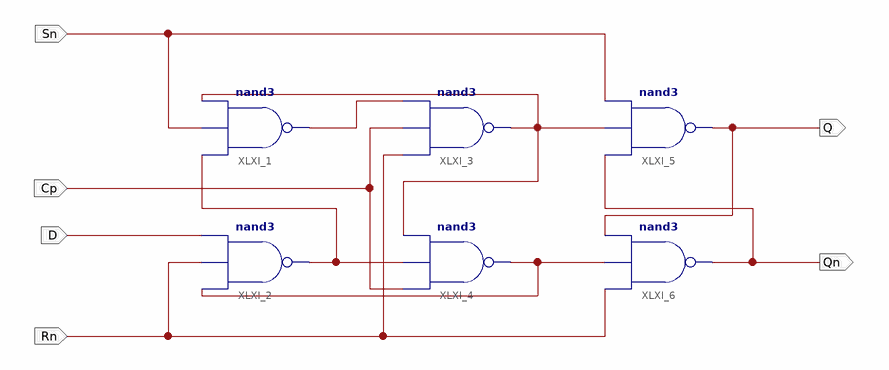
[diagram p0: schematic sheet 1]
// Xilinx ISE schematic MB_DFF.sch (kintex7) as structural Verilog: 6 symbols, 6 ports
module MB_DFF (
  input  Sn,
  input  Cp,
  input  D,
  input  Rn,
  output Qn,
  output Q
);

  wire XLXN_3, XLXN_7, XLXN_9, XLXN_13;

  nand XLXI_1 (XLXN_3, XLXN_9, Sn, XLXN_7);
  nand XLXI_3 (XLXN_7, Rn, Cp, XLXN_3);
  nand XLXI_5 (Q, Qn, XLXN_7, Sn);
  nand XLXI_2 (XLXN_9, XLXN_13, Rn, D);
  nand XLXI_4 (XLXN_13, Cp, XLXN_9, XLXN_7);
  nand XLXI_6 (Qn, Rn, XLXN_13, Q);
endmodule
